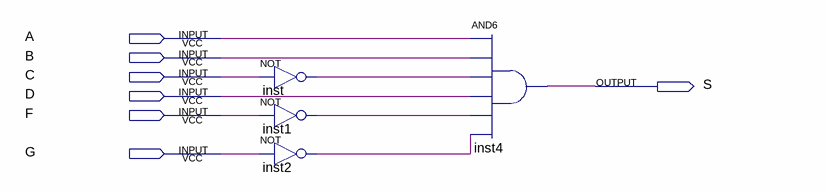
[diagram p0: schematic sheet]
// Quartus schematic Block4.bdf as structural Verilog: 4 symbols, 7 pins
module Block4 (
  input  A,
  input  B,
  input  C,
  input  D,
  input  F,
  input  G,
  output S
);

  wire inst1_out, inst2_out, inst_out;

  not inst (inst_out, C);
  not inst1 (inst1_out, F);
  not inst2 (inst2_out, G);
  and inst4 (S, A, B, inst_out, D, inst1_out, inst2_out);
endmodule
